# Altium schematic sheet Copy of Delay.SchDoc (part 4 of 4)
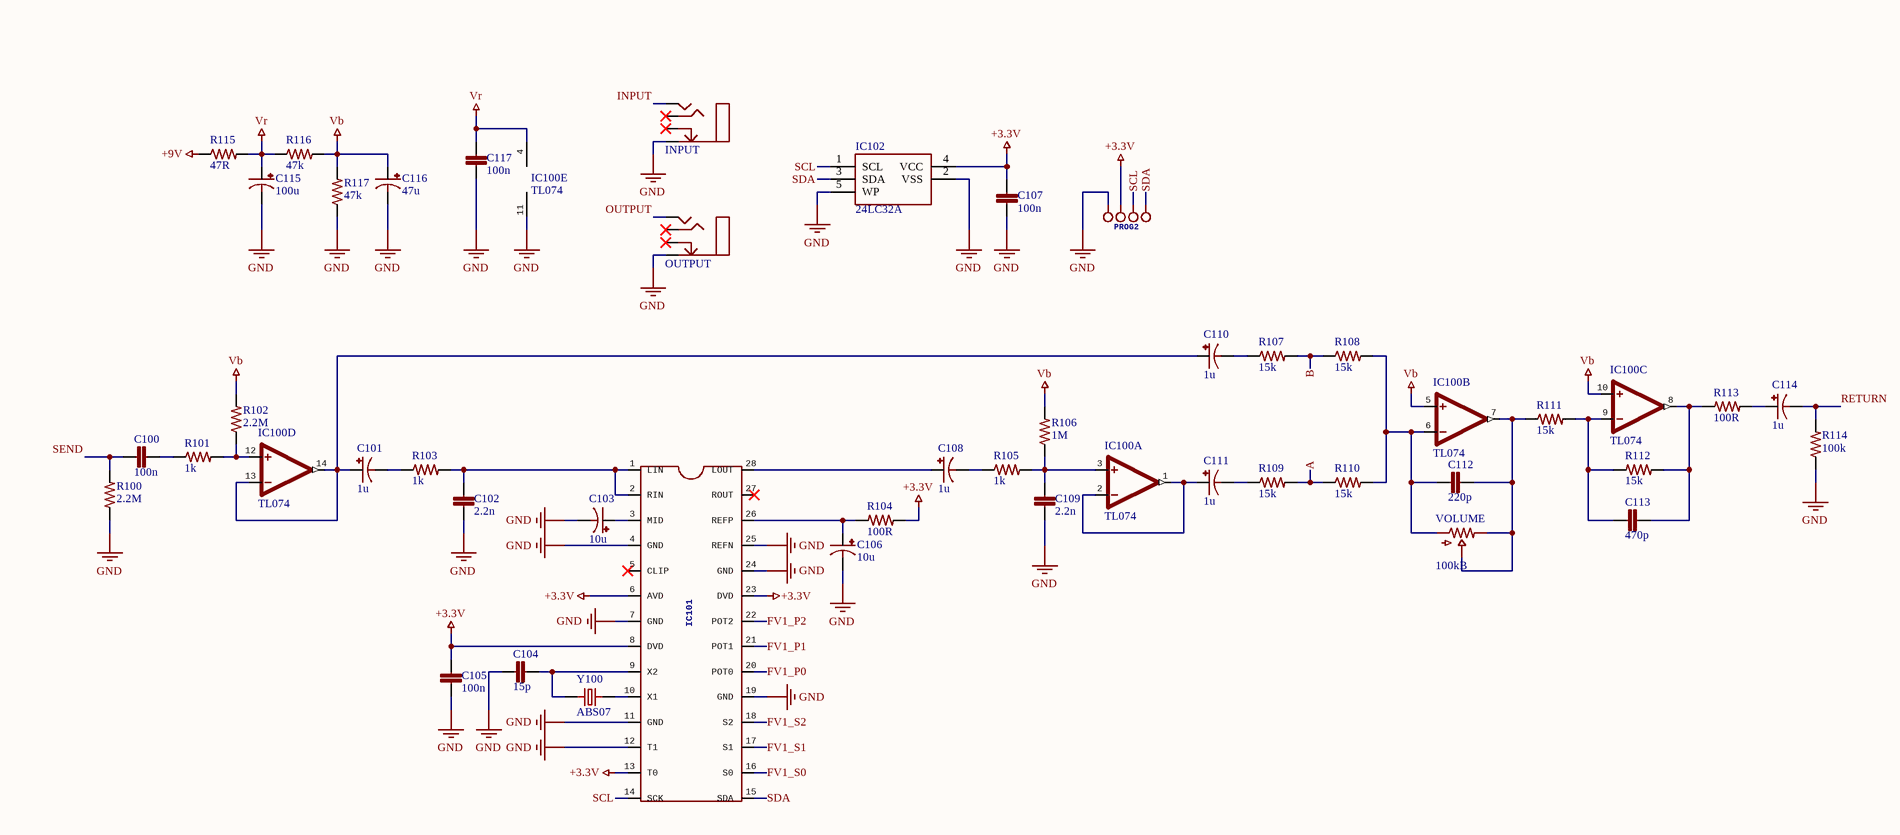
[diagram p5: Copy of Delay.SchDoc, bottom left]

## Library data of the parts (continued)
REG1 = UA78M33CDCYR: IC REG LIN 3.3V 500MA SOT223-4; Manufacturer: Texas Instruments; Dropout Voltage: 2V; Number of Outputs: 1; Min Input Voltage: 5.3V; Max Input Voltage: 25V; Polarity: Positive; Power Supply Rejection Ratio (PSRR): 80dB; Quiescent Current: 4.5mA; Output Type: Fixed; Supplier 1: Farnell; Supplier Part Number 1: 3008103; Manufacturer Part Number: UA78M33CDCYR; RoHS: Yes; Category: Voltage Regulators - Linear; Stock: 16789; Pricing: 1=0.49500, 50=0.43200, 100=0.27900, 250=0.26000, 500=0.24200, 1000=0.22300, 2500=0.20200, 5000=0.18600 (EUR); Mount: Surface Mount; Case/Package: SOT-223-4; Number of Pins: 4; Weight: 0.006632oz; Contact Plating: Tin,Matte; Min Operating Temperature: -40°C; Max Operating Temperature: 125°C; Output Current: 500mA; Output Voltage: 3.3V; Packaging: Tape and Reel; Package Quantity: 1; Max Output Current: 500mA; Number of Regulators: 1; Nominal Output Voltage: 3.3V; Radiation Hardening: No; Lead Free: Lead Free; REACH SVHC: No SVHC; ComponentLink1URL: https://datasheet.ciiva.com/2042/ua78m05-2042173.pdf?src-supplier=Digi-Key; ComponentLink1Description: https://datasheet.ciiva.com/2042/ua78m05-2042173.pdf?src-supplier=Digi-Key; ComponentLink2URL: https://datasheet.ciiva.com/46395/1882046-46395062.pdf?src-supplier=Element14; ComponentLink2Description: https://datasheet.ciiva.com/46395/1882046-46395062.pdf?src-supplier=Element14; ComponentLink3URL: https://datasheet.ciiva.com/7992/1882046-7992586.pdf?src-supplier=Element14; ComponentLink3Description: https://datasheet.ciiva.com/7992/1882046-7992586.pdf?src-supplier=Element14; ComponentLink4URL: https://datasheet.ciiva.com/2042/ua78m05-2042171.pdf?src-supplier=Digi-Key; ComponentLink4Description: https://datasheet.ciiva.com/2042/ua78m05-2042171.pdf?src-supplier=Digi-Key; ComponentLink5URL: https://datasheet.ciiva.com/3224/ua78m05-3224619.pdf?src-supplier=Avnet; ComponentLink5Description: https://datasheet.ciiva.com/3224/ua78m05-3224619.pdf?src-supplier=Avnet; ComponentLink6URL: https://datasheet.ciiva.com/2042/ua78m05-2042172.pdf?src-supplier=Digi-Key; ComponentLink6Description: https://datasheet.ciiva.com/2042/ua78m05-2042172.pdf?src-supplier=Digi-Key; ComponentLink7URL: https://datasheet.ciiva.com/26170/ua78m12-26170716.pdf?src-supplier=Avnet+Europe; ComponentLink7Description: https://datasheet.ciiva.com/26170/ua78m12-26170716.pdf?src-supplier=Avnet+Europe; ComponentLink8URL: https://datasheet.ciiva.com/41463/001015184-da-01-en-ic-reg-3-3v-u-ua78m33cdcyr-sot-223-4-tid-41463029.pdf?src-supplier=Conrad; ComponentLink8Description: https://datasheet.ciiva.com/41463/001015184-da-01-en-ic-reg-3-3v-u-ua78m33cdcyr-sot-223-4-tid-41463029.pdf?src-supplier=Conrad
S1 = ENC_EC11
U1 = ATMEGA1284-AU: Integrated Circuit; Manufacturer_Name: Microchip; Datasheet Link: http://ww1.microchip.com/downloads/en/devicedoc/atmel-42718-atmega1284_datasheet_summary.pdf; Height: 1.2mm; Manufacturer_Part_Number: ATMEGA1284-AU
UART = J_HEADER_2PINS_FEM: 2 Pins female header; Pin spacing: 2.54mm; Price: 0.01
VOLUME = POT_100kB_ALPHA_9mm: 100k Lin potentiometer round shaft; Price: 1.3; Dimensions: 9mm; Package: PCB Mounted
Y100 = ABS07-32.768KHZ-T: CRYSTAL 32.7680KHZ 12.5PF SMD; Manufacturer: Abracon; Frequency Tolerance: 20ppm; ESR (Equivalent Series Resistance): 70kR; Supplier 1: Farnell; Supplier Part Number 1: 2101347; Manufacturer Part Number: ABS07-32.768KHZ-T; RoHS: Yes; Category: Crystals; Stock: 222445; Pricing: 5=0.65300, 50=0.44800, 250=0.43500, 500=0.34800, 1500=0.31800, 3000=0.28700, 15000=0.28500 (EUR); Case/Package: CSMD; Number of Pins: 2; Min Operating Temperature: -40°C; Max Operating Temperature: 85°C; Load Capacitance: 12.5pF; Frequency: 32.768kHz; Packaging: Tape and Reel; Package Quantity: 3000; Tolerance: 20ppm; Termination: SMD/SMT; Series Resistance: 70kR; Length: 3.2mm; Height: 0.035inch; Width: 0.061inch; Depth: 1.5mm; Radiation Hardening: No; Lead Free: Lead Free; REACH SVHC: No SVHC; ComponentLink1URL: https://datasheet.ciiva.com/854/abs07-854935.pdf?src-supplier=Digi-Key; ComponentLink1Description: https://datasheet.ciiva.com/854/abs07-854935.pdf?src-supplier=Digi-Key; ComponentLink2URL: https://datasheet.ciiva.com/1357/1883680-1357319.pdf?src-supplier=Element14; ComponentLink2Description: https://datasheet.ciiva.com/1357/1883680-1357319.pdf?src-supplier=Element14; ComponentLink3URL: https://datasheet.ciiva.com/854/abs07-854936.pdf?src-supplier=Digi-Key; ComponentLink3Description: https://datasheet.ciiva.com/854/abs07-854936.pdf?src-supplier=Digi-Key; ComponentLink4URL: https://datasheet.ciiva.com/854/abs07-854937.pdf?src-supplier=Digi-Key; ComponentLink4Description: https://datasheet.ciiva.com/854/abs07-854937.pdf?src-supplier=Digi-Key; ComponentLink5URL: https://datasheet.ciiva.com/15214/getdatasheetpartid-727011-15214954.pdf?src-supplier=Verical; ComponentLink5Description: https://datasheet.ciiva.com/15214/getdatasheetpartid-727011-15214954.pdf?src-supplier=Verical; ComponentLink6URL: https://datasheet.ciiva.com/7998/1912628-7998667.pdf?src-supplier=Element14; ComponentLink6Description: https://datasheet.ciiva.com/7998/1912628-7998667.pdf?src-supplier=Element14; ComponentLink7URL: https://datasheet.ciiva.com/4944/abs07-11028-4944830.pdf?src-supplier=Mouser; ComponentLink7Description: https://datasheet.ciiva.com/4944/abs07-11028-4944830.pdf?src-supplier=Mouser

## Notes on the sheet
- (in symbol UA78M33CDCYR) I; O; G